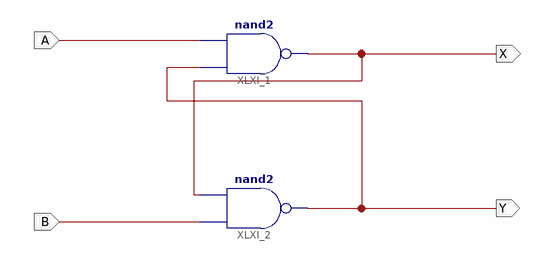
[diagram p0: schematic sheet 1]
// Xilinx ISE schematic Nand_Latch.sch (spartan3e) as structural Verilog: 2 symbols, 4 ports
module Nand_Latch (
  input  B,
  input  A,
  output Y,
  output X
);

  nand XLXI_2 (Y, B, X);
  nand XLXI_1 (X, Y, A);
endmodule
